# Altium schematic sheet MXM_Connector.SchDoc
size D
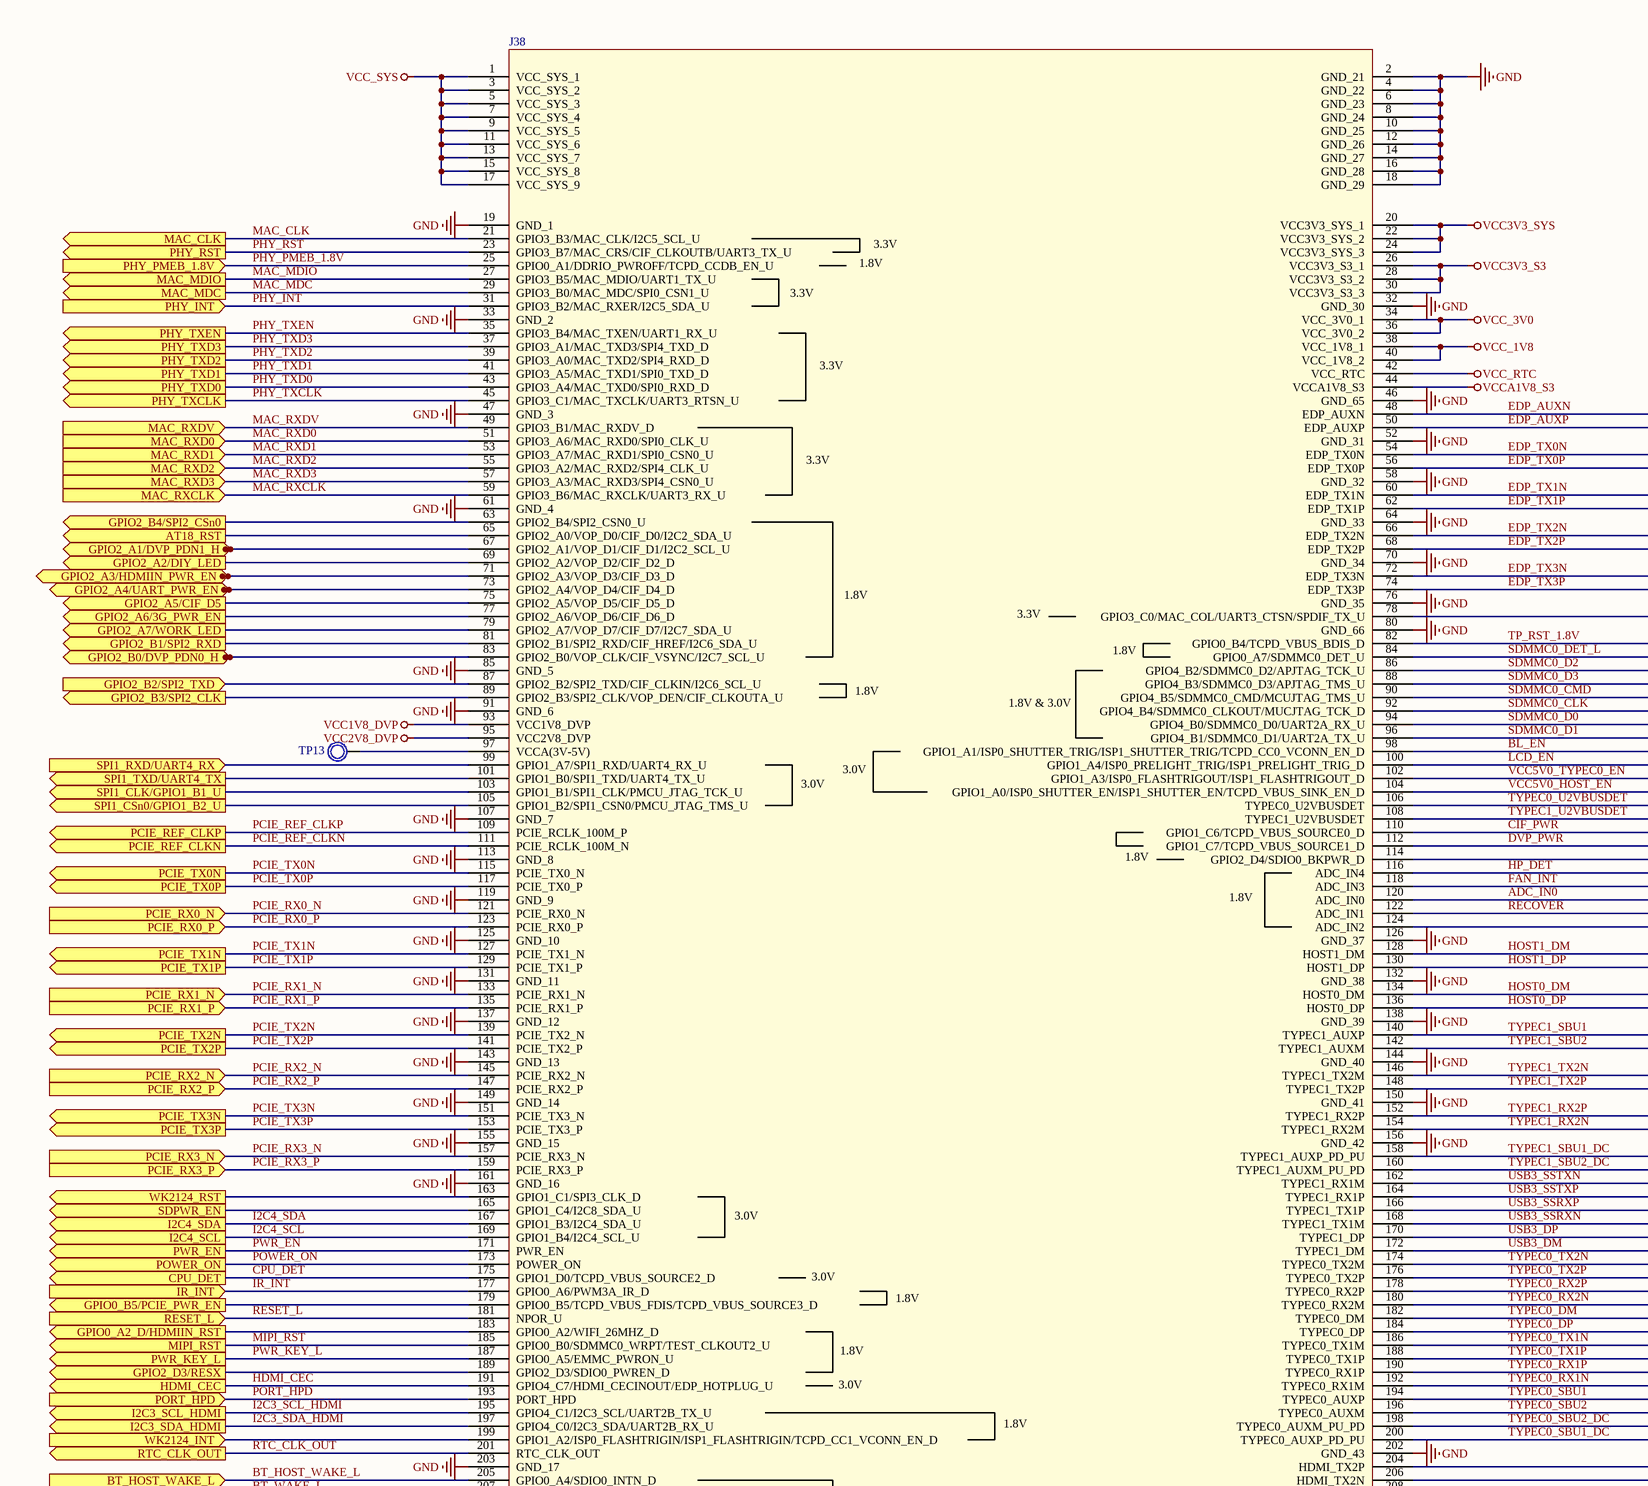
[diagram p0: MXM_Connector.SchDoc, top left]
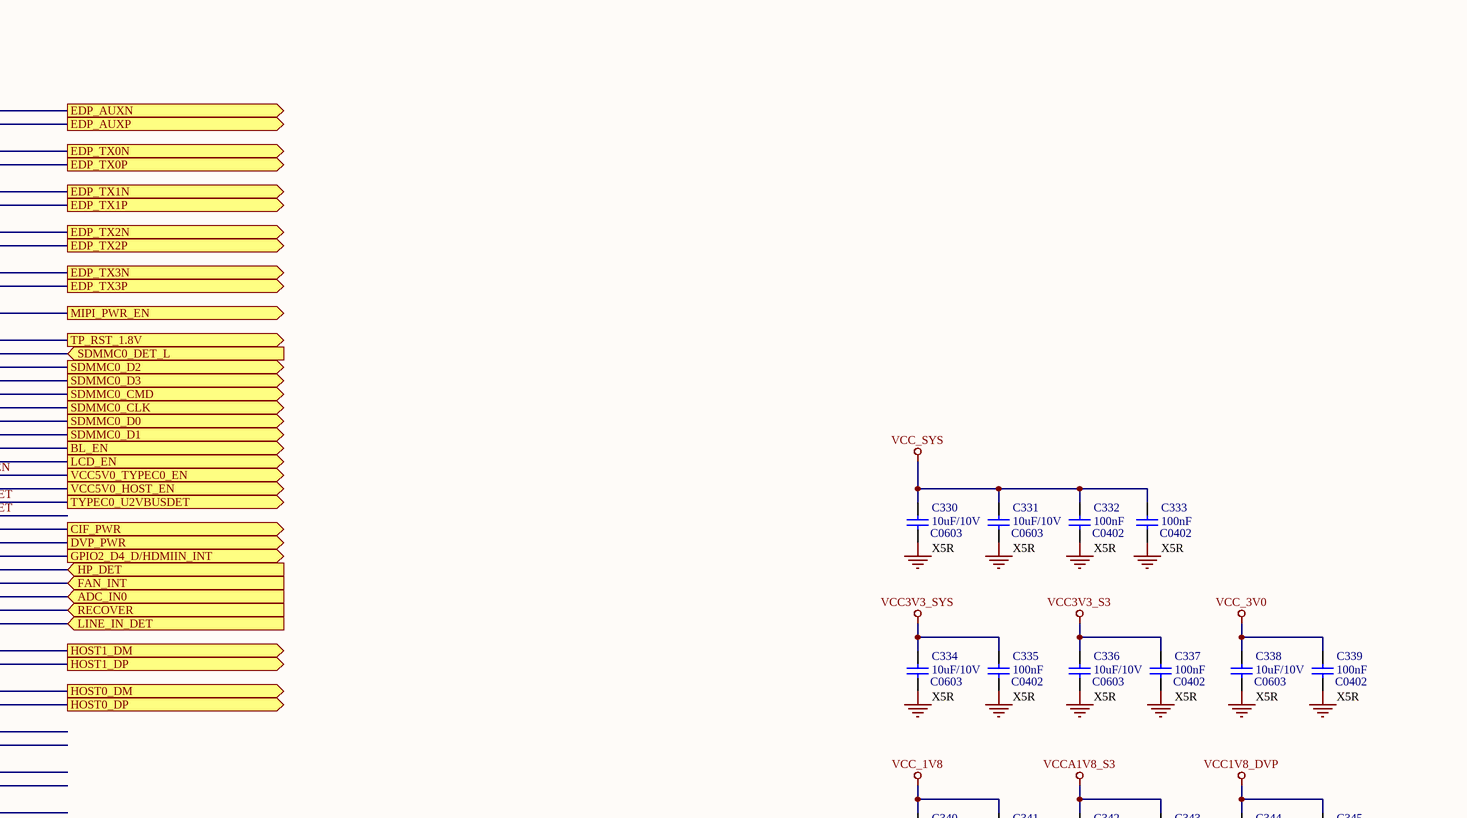
[diagram p1: MXM_Connector.SchDoc, top right]
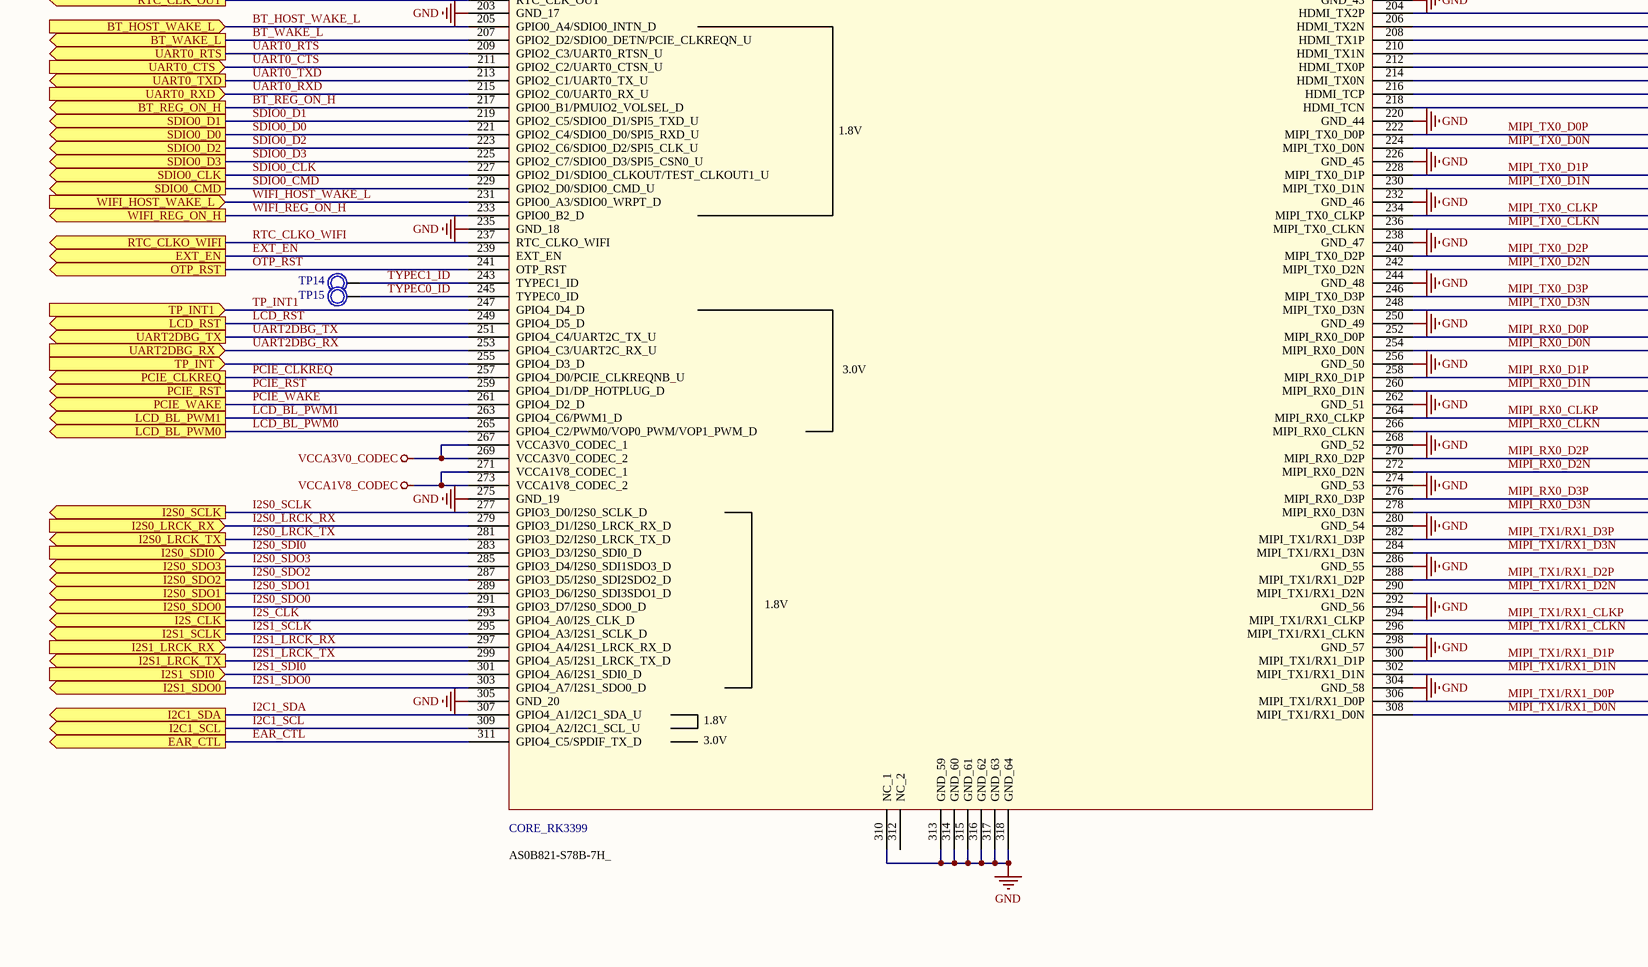
[diagram p2: MXM_Connector.SchDoc, bottom left]
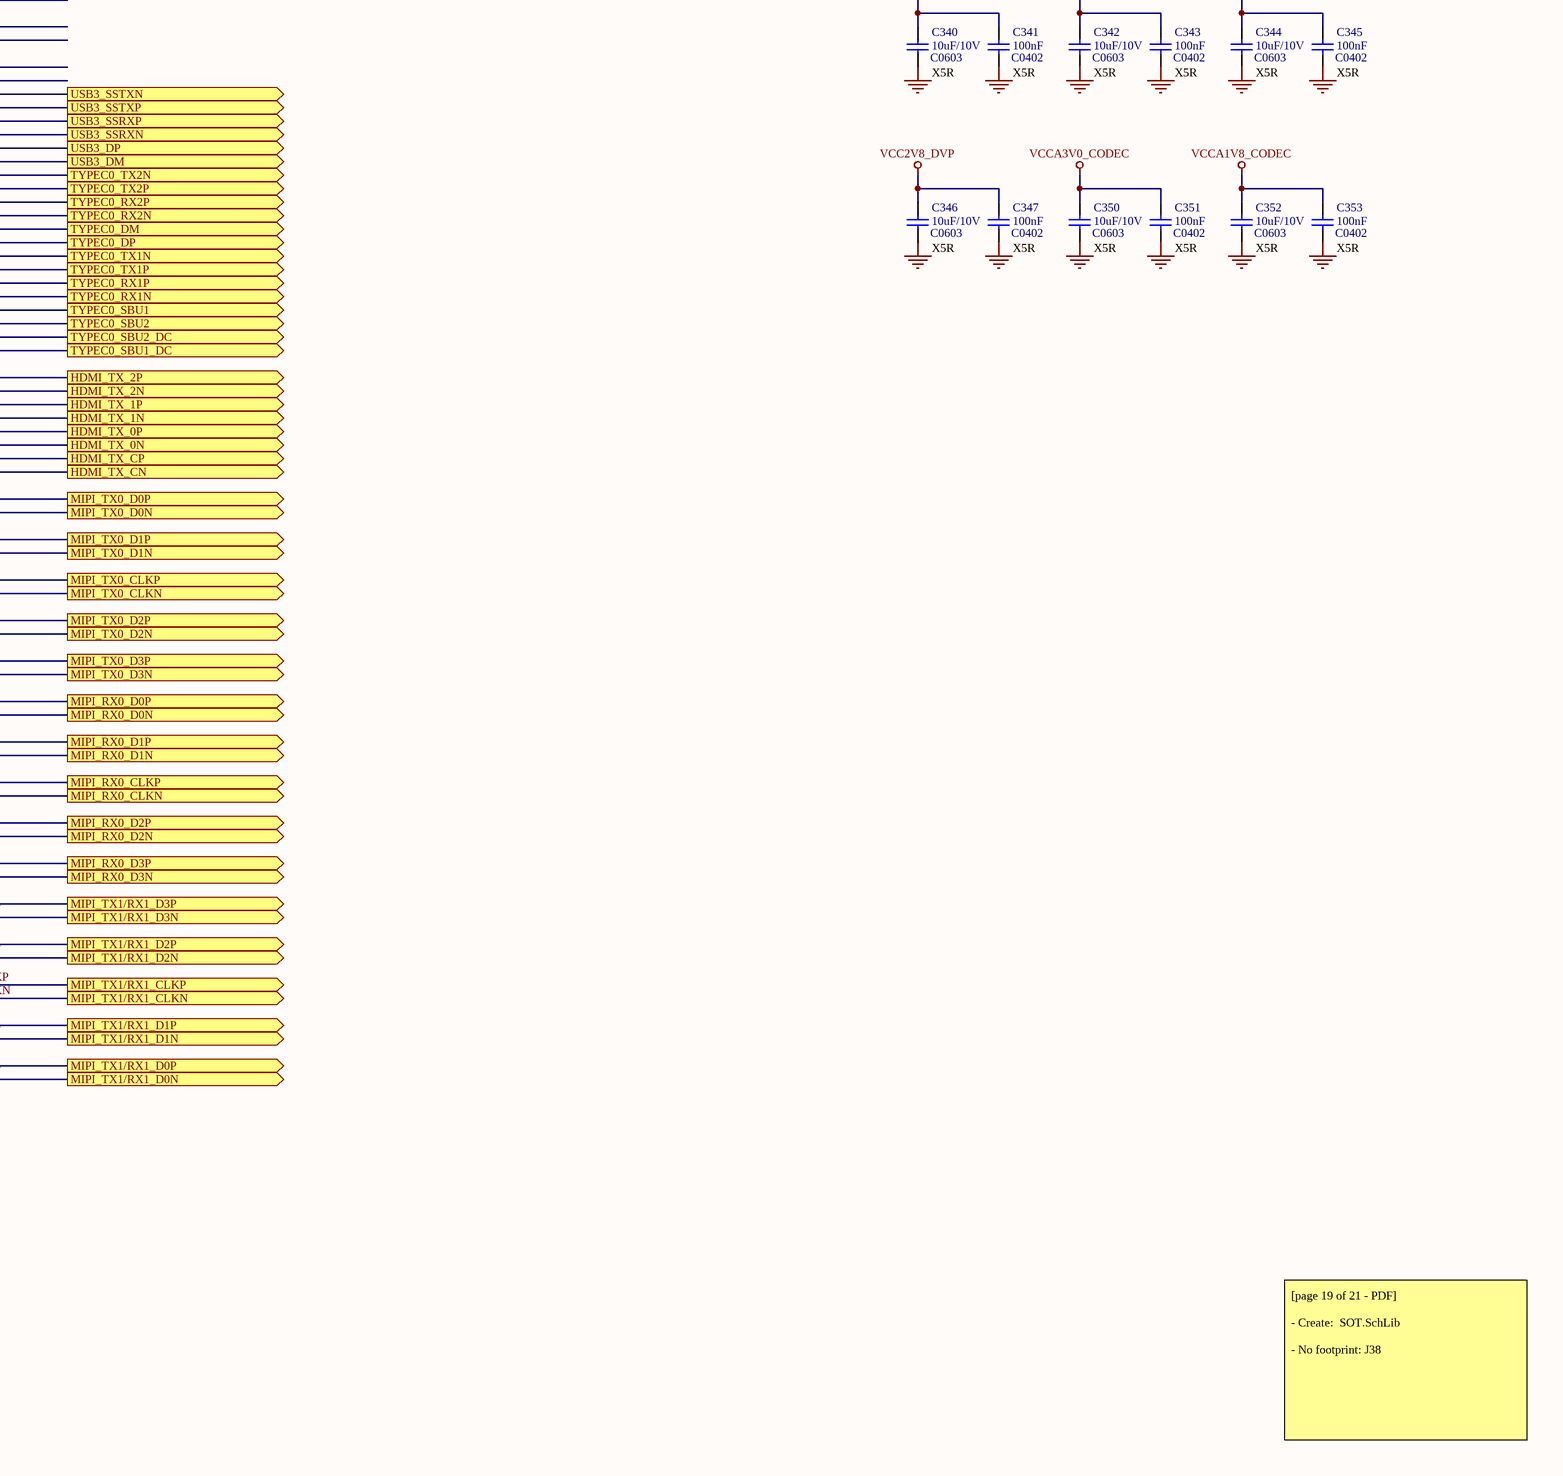
[diagram p3: MXM_Connector.SchDoc, bottom right]

## Parts
C330  C0603  value 10uF/10V  [C 0603]
C331  C0603  value 10uF/10V  [C 0603]
C332  C0402  value 100nF  [C 0402]
C333  C0402  value 100nF  [C 0402]
C334  C0603  value 10uF/10V  [C 0603]
C335  C0402  value 100nF  [C 0402]
C336  C0603  value 10uF/10V  [C 0603]
C337  C0402  value 100nF  [C 0402]
C338  C0603  value 10uF/10V  [C 0603]
C339  C0402  value 100nF  [C 0402]
C340  C0603  value 10uF/10V  [C 0603]
C341  C0402  value 100nF  [C 0402]
C342  C0603  value 10uF/10V  [C 0603]
C343  C0402  value 100nF  [C 0402]
C344  C0603  value 10uF/10V  [C 0603]
C345  C0402  value 100nF  [C 0402]
C346  C0603  value 10uF/10V  [C 0603]
C347  C0402  value 100nF  [C 0402]
C350  C0603  value 10uF/10V  [C 0603]
C351  C0402  value 100nF  [C 0402]
C352  C0603  value 10uF/10V  [C 0603]
C353  C0402  value 100nF  [C 0402]
J38  CORE_RK3399  Package: AS0B821-S78B-7H_  [*FOX_AS0B821-S78B-7H_AS0B821-S78B-7H(Primary)]
TP13  TP  [TP1]  (value not drawn)
TP14  TP  [TP1]  (value not drawn)
TP15  TP  [TP1]  (value not drawn)

## Ports
ADC_IN0 (in), AT18_RST (out), BL_EN (out), BT_HOST_WAKE_L (in), BT_REG_ON_H (out), BT_WAKE_L (out), CIF_PWR (out), CPU_DET (out), DVP_PWR (out), EAR_CTL (out), EDP_AUXN (out), EDP_AUXP (out), EDP_TX0N (out), EDP_TX0P (out), EDP_TX1N (out), EDP_TX1P (out), EDP_TX2N (out), EDP_TX2P (out), EDP_TX3N (out), EDP_TX3P (out), EXT_EN (out), FAN_INT (in), GPIO0_A2_D/HDMIIN_RST (out), GPIO0_B5/PCIE_PWR_EN (out), GPIO2_A1/DVP_PDN1_H (out), GPIO2_A2/DIY_LED (out), GPIO2_A3/HDMIIN_PWR_EN (out), GPIO2_A4/UART_PWR_EN (out), GPIO2_A5/CIF_D5 (out), GPIO2_A6/3G_PWR_EN (out), GPIO2_A7/WORK_LED (out), GPIO2_B0/DVP_PDN0_H (out), GPIO2_B1/SPI2_RXD (out), GPIO2_B2/SPI2_TXD (in), GPIO2_B3/SPI2_CLK (out), GPIO2_B4/SPI2_CSn0 (out), GPIO2_D3/RESX (out), GPIO2_D4_D/HDMIIN_INT (out), HDMI_CEC (out), HDMI_TX_0N (out), HDMI_TX_0P (out), HDMI_TX_1N (out), HDMI_TX_1P (out), HDMI_TX_2N (out), HDMI_TX_2P (out), HDMI_TX_CN (out), HDMI_TX_CP (out), HOST0_DM (out), HOST0_DP (out), HOST1_DM (out), HOST1_DP (out), HP_DET (in), I2C1_SCL (out), I2C1_SDA (out), I2C3_SCL_HDMI (out), I2C3_SDA_HDMI (out), I2C4_SCL (out), I2C4_SDA (out), I2S0_LRCK_RX (in), I2S0_LRCK_TX (out), I2S0_SCLK (out), I2S0_SDI0 (in), I2S0_SDO0 (out), I2S0_SDO1 (out), I2S0_SDO2 (out), I2S0_SDO3 (out), I2S1_LRCK_RX (in), I2S1_LRCK_TX (out), I2S1_SCLK (out), I2S1_SDI0 (in), I2S1_SDO0 (out), I2S_CLK (out), IR_INT (in), LCD_BL_PWM0 (out), LCD_BL_PWM1 (out), LCD_EN (out), LCD_RST (out), LINE_IN_DET (in), MAC_CLK (out), MAC_MDC (out), MAC_MDIO (out), MAC_RXCLK (in), MAC_RXD0 (in), MAC_RXD1 (in), MAC_RXD2 (in), MAC_RXD3 (in), MAC_RXDV (in), MIPI_PWR_EN (out), MIPI_RST (out), MIPI_RX0_CLKN (out), MIPI_RX0_CLKP (out), MIPI_RX0_D0N (out), MIPI_RX0_D0P (out), MIPI_RX0_D1N (out), MIPI_RX0_D1P (out), MIPI_RX0_D2N (out), MIPI_RX0_D2P (out), MIPI_RX0_D3N (out), MIPI_RX0_D3P (out), MIPI_TX0_CLKN (out), MIPI_TX0_CLKP (out), MIPI_TX0_D0N (out), MIPI_TX0_D0P (out), MIPI_TX0_D1N (out), MIPI_TX0_D1P (out), MIPI_TX0_D2N (out), MIPI_TX0_D2P (out), MIPI_TX0_D3N (out), MIPI_TX0_D3P (out), MIPI_TX1/RX1_CLKN (out), MIPI_TX1/RX1_CLKP (out), MIPI_TX1/RX1_D0N (out), MIPI_TX1/RX1_D0P (out), MIPI_TX1/RX1_D1N (out), MIPI_TX1/RX1_D1P (out), MIPI_TX1/RX1_D2N (out), MIPI_TX1/RX1_D2P (out), MIPI_TX1/RX1_D3N (out), MIPI_TX1/RX1_D3P (out), OTP_RST (out), PCIE_CLKREQ (out), PCIE_REF_CLKN (out), PCIE_REF_CLKP (out), PCIE_RST (out), PCIE_RX0_N (in), PCIE_RX0_P (in), PCIE_RX1_N (in), PCIE_RX1_P (in), PCIE_RX2_N (in), PCIE_RX2_P (in), PCIE_RX3_N (in), PCIE_RX3_P (in), PCIE_TX0N (out), PCIE_TX0P (out), PCIE_TX1N (out), PCIE_TX1P (out), PCIE_TX2N (out), PCIE_TX2P (out), PCIE_TX3N (out), PCIE_TX3P (out), PCIE_WAKE (out), PHY_INT (in), PHY_PMEB_1.8V (in), PHY_RST (out), PHY_TXCLK (out), PHY_TXD0 (out), PHY_TXD1 (out), PHY_TXD2 (out), PHY_TXD3 (out), PHY_TXEN (out), PORT_HPD (in), POWER_ON (out), PWR_EN (out), PWR_KEY_L (out), RECOVER (in), RESET_L (in), RTC_CLK_OUT (out), RTC_CLKO_WIFI (out), SDIO0_CLK (out), SDIO0_CMD (out), SDIO0_D0 (out), SDIO0_D1 (out), SDIO0_D2 (out), SDIO0_D3 (out), SDMMC0_CLK (out), SDMMC0_CMD (out), SDMMC0_D0 (out), SDMMC0_D1 (out), SDMMC0_D2 (out), SDMMC0_D3 (out), SDMMC0_DET_L (in), SDPWR_EN (out), SPI1_CLK/GPIO1_B1_U (out), SPI1_CSn0/GPIO1_B2_U (out), SPI1_RXD/UART4_RX (in), SPI1_TXD/UART4_TX (out), TP_INT1 (in), TP_INT (in), TP_RST_1.8V (out), TYPEC0_DM (out), TYPEC0_DP (out), TYPEC0_RX1N (out), TYPEC0_RX1P (out), TYPEC0_RX2N (out), TYPEC0_RX2P (out), TYPEC0_SBU1 (out), TYPEC0_SBU1_DC (out), TYPEC0_SBU2 (out), TYPEC0_SBU2_DC (out), TYPEC0_TX1N (out), TYPEC0_TX1P (out), TYPEC0_TX2N (out), TYPEC0_TX2P (out), TYPEC0_U2VBUSDET (out), UART0_CTS (in), UART0_RTS (out), UART0_RXD (in), UART0_TXD (out), UART2DBG_RX (in), UART2DBG_TX (out), USB3_DM (out), USB3_DP (out), USB3_SSRXN (out), USB3_SSRXP (out), USB3_SSTXN (out), USB3_SSTXP (out), VCC5V0_HOST_EN (out), VCC5V0_TYPEC0_EN (out), WIFI_HOST_WAKE_L (in), WIFI_REG_ON_H (out), WK2124_INT (in), WK2124_RST (out)

## Nets
GND: C330.2 C331.2 C332.2 C333.2 C334.2 C335.2 C336.2 C337.2 C338.2 C339.2 C340.2 C341.2 C342.2 C343.2 C344.2 C345.2 C346.2 C347.2 C350.2 C351.2 C352.2 C353.2 J38.2(GND_21) J38.4(GND_22) J38.6(GND_23) J38.8(GND_24) J38.10(GND_25) J38.12(GND_26) J38.14(GND_27) J38.16(GND_28) J38.18(GND_29) J38.19(GND_1) J38.32(GND_30) J38.33(GND_2) J38.46(GND_65) J38.47(GND_3) J38.52(GND_31) J38.58(GND_32) J38.61(GND_4) J38.64(GND_33) J38.70(GND_34) J38.76(GND_35) J38.80(GND_66) J38.85(GND_5) J38.91(GND_6) J38.107(GND_7) J38.113(GND_8) J38.119(GND_9) J38.125(GND_10) J38.126(GND_37) J38.131(GND_11) J38.132(GND_38) J38.137(GND_12) J38.138(GND_39) J38.143(GND_13) J38.144(GND_40) J38.149(GND_14) J38.150(GND_41) J38.155(GND_15) J38.156(GND_42) J38.161(GND_16) J38.202(GND_43) J38.203(GND_17) J38.220(GND_44) J38.226(GND_45) J38.232(GND_46) J38.235(GND_18) J38.238(GND_47) J38.244(GND_48) J38.250(GND_49) J38.256(GND_50) J38.262(GND_51) J38.268(GND_52) J38.274(GND_53) J38.275(GND_19) J38.280(GND_54) J38.286(GND_55) J38.292(GND_56) J38.298(GND_57) J38.304(GND_58) J38.305(GND_20) J38.310(NC_1) J38.313(GND_59) J38.314(GND_60) J38.315(GND_61) J38.316(GND_62) J38.317(GND_63) J38.318(GND_64)
VCC1V8_DVP: C344.1 C345.1 J38.93(VCC1V8_DVP)
VCC2V8_DVP: C346.1 C347.1 J38.95(VCC2V8_DVP)
VCC3V3_S3: C336.1 C337.1 J38.26(VCC3V3_S3_1) J38.28(VCC3V3_S3_2) J38.30(VCC3V3_S3_3)
VCC3V3_SYS: C334.1 C335.1 J38.20(VCC3V3_SYS_1) J38.22(VCC3V3_SYS_2) J38.24(VCC3V3_SYS_3)
VCC_1V8: C340.1 C341.1 J38.38(VCC_1V8_1) J38.40(VCC_1V8_2)
VCC_3V0: C338.1 C339.1 J38.34(VCC_3V0_1) J38.36(VCC_3V0_2)
VCC_RTC: J38.42(VCC_RTC)
VCC_SYS: C330.1 C331.1 C332.1 C333.1 J38.1(VCC_SYS_1) J38.3(VCC_SYS_2) J38.5(VCC_SYS_3) J38.7(VCC_SYS_4) J38.9(VCC_SYS_5) J38.11(VCC_SYS_6) J38.13(VCC_SYS_7) J38.15(VCC_SYS_8) J38.17(VCC_SYS_9)
VCCA1V8_CODEC: C352.1 C353.1 J38.271(VCCA1V8_CODEC_1) J38.273(VCCA1V8_CODEC_2)
VCCA1V8_S3: C342.1 C343.1 J38.44(VCCA1V8_S3)
VCCA3V0_CODEC: C350.1 C351.1 J38.267(VCCA3V0_CODEC_1) J38.269(VCCA3V0_CODEC_2)
ADC_IN0: J38.120(ADC_IN0) ; port ADC_IN0
AT18_RST: J38.65(GPIO2_A0/VOP_D0/CIF_D0/I2C2_SDA_U) ; port AT18_RST
BL_EN: J38.98(GPIO1_A1/ISP0_SHUTTER_TRIG/ISP1_SHUTTER_TRIG/TCPD_CC0_VCONN_EN_D) ; port BL_EN
BT_HOST_WAKE_L: J38.205(GPIO0_A4/SDIO0_INTN_D) ; port BT_HOST_WAKE_L
BT_REG_ON_H: J38.217(GPIO0_B1/PMUIO2_VOLSEL_D) ; port BT_REG_ON_H
BT_WAKE_L: J38.207(GPIO2_D2/SDIO0_DETN/PCIE_CLKREQN_U) ; port BT_WAKE_L
CIF_PWR: J38.110(GPIO1_C6/TCPD_VBUS_SOURCE0_D) ; port CIF_PWR
CPU_DET: J38.175(GPIO1_D0/TCPD_VBUS_SOURCE2_D) ; port CPU_DET
DVP_PWR: J38.112(GPIO1_C7/TCPD_VBUS_SOURCE1_D) ; port DVP_PWR
EAR_CTL: J38.311(GPIO4_C5/SPDIF_TX_D) ; port EAR_CTL
EDP_AUXN: J38.48(EDP_AUXN) ; port EDP_AUXN
EDP_AUXP: J38.50(EDP_AUXP) ; port EDP_AUXP
EDP_TX0N: J38.54(EDP_TX0N) ; port EDP_TX0N
EDP_TX0P: J38.56(EDP_TX0P) ; port EDP_TX0P
EDP_TX1N: J38.60(EDP_TX1N) ; port EDP_TX1N
EDP_TX1P: J38.62(EDP_TX1P) ; port EDP_TX1P
EDP_TX2N: J38.66(EDP_TX2N) ; port EDP_TX2N
EDP_TX2P: J38.68(EDP_TX2P) ; port EDP_TX2P
EDP_TX3N: J38.72(EDP_TX3N) ; port EDP_TX3N
EDP_TX3P: J38.74(EDP_TX3P) ; port EDP_TX3P
EXT_EN: J38.239(EXT_EN) ; port EXT_EN
FAN_INT: J38.118(ADC_IN3) ; port FAN_INT
GPIO0_A2_D/HDMIIN_RST: J38.183(GPIO0_A2/WIFI_26MHZ_D) ; port GPIO0_A2_D/HDMIIN_RST
GPIO0_B5/PCIE_PWR_EN: J38.179(GPIO0_B5/TCPD_VBUS_FDIS/TCPD_VBUS_SOURCE3_D) ; port GPIO0_B5/PCIE_PWR_EN
GPIO2_A1/DVP_PDN1_H: J38.67(GPIO2_A1/VOP_D1/CIF_D1/I2C2_SCL_U) ; port GPIO2_A1/DVP_PDN1_H
GPIO2_A2/DIY_LED: J38.69(GPIO2_A2/VOP_D2/CIF_D2_D) ; port GPIO2_A2/DIY_LED
GPIO2_A3/HDMIIN_PWR_EN: J38.71(GPIO2_A3/VOP_D3/CIF_D3_D) ; port GPIO2_A3/HDMIIN_PWR_EN
GPIO2_A4/UART_PWR_EN: J38.73(GPIO2_A4/VOP_D4/CIF_D4_D) ; port GPIO2_A4/UART_PWR_EN
GPIO2_A5/CIF_D5: J38.75(GPIO2_A5/VOP_D5/CIF_D5_D) ; port GPIO2_A5/CIF_D5
GPIO2_A6/3G_PWR_EN: J38.77(GPIO2_A6/VOP_D6/CIF_D6_D) ; port GPIO2_A6/3G_PWR_EN
GPIO2_A7/WORK_LED: J38.79(GPIO2_A7/VOP_D7/CIF_D7/I2C7_SDA_U) ; port GPIO2_A7/WORK_LED
GPIO2_B0/DVP_PDN0_H: J38.83(GPIO2_B0/VOP_CLK/CIF_VSYNC/I2C7_SCL_U) ; port GPIO2_B0/DVP_PDN0_H
GPIO2_B1/SPI2_RXD: J38.81(GPIO2_B1/SPI2_RXD/CIF_HREF/I2C6_SDA_U) ; port GPIO2_B1/SPI2_RXD
GPIO2_B2/SPI2_TXD: J38.87(GPIO2_B2/SPI2_TXD/CIF_CLKIN/I2C6_SCL_U) ; port GPIO2_B2/SPI2_TXD
GPIO2_B3/SPI2_CLK: J38.89(GPIO2_B3/SPI2_CLK/VOP_DEN/CIF_CLKOUTA_U) ; port GPIO2_B3/SPI2_CLK
GPIO2_B4/SPI2_CSn0: J38.63(GPIO2_B4/SPI2_CSN0_U) ; port GPIO2_B4/SPI2_CSn0
GPIO2_D3/RESX: J38.189(GPIO2_D3/SDIO0_PWREN_D) ; port GPIO2_D3/RESX
GPIO2_D4_D/HDMIIN_INT: J38.114(GPIO2_D4/SDIO0_BKPWR_D) ; port GPIO2_D4_D/HDMIIN_INT
HDMI_CEC: J38.191(GPIO4_C7/HDMI_CECINOUT/EDP_HOTPLUG_U) ; port HDMI_CEC
HDMI_TX_0N: J38.214(HDMI_TX0N) ; port HDMI_TX_0N
HDMI_TX_0P: J38.212(HDMI_TX0P) ; port HDMI_TX_0P
HDMI_TX_1N: J38.210(HDMI_TX1N) ; port HDMI_TX_1N
HDMI_TX_1P: J38.208(HDMI_TX1P) ; port HDMI_TX_1P
HDMI_TX_2N: J38.206(HDMI_TX2N) ; port HDMI_TX_2N
HDMI_TX_2P: J38.204(HDMI_TX2P) ; port HDMI_TX_2P
HDMI_TX_CN: J38.218(HDMI_TCN) ; port HDMI_TX_CN
HDMI_TX_CP: J38.216(HDMI_TCP) ; port HDMI_TX_CP
HOST0_DM: J38.134(HOST0_DM) ; port HOST0_DM
HOST0_DP: J38.136(HOST0_DP) ; port HOST0_DP
HOST1_DM: J38.128(HOST1_DM) ; port HOST1_DM
HOST1_DP: J38.130(HOST1_DP) ; port HOST1_DP
HP_DET: J38.116(ADC_IN4) ; port HP_DET
I2C1_SCL: J38.309(GPIO4_A2/I2C1_SCL_U) ; port I2C1_SCL
I2C1_SDA: J38.307(GPIO4_A1/I2C1_SDA_U) ; port I2C1_SDA
I2C3_SCL_HDMI: J38.195(GPIO4_C1/I2C3_SCL/UART2B_TX_U) ; port I2C3_SCL_HDMI
I2C3_SDA_HDMI: J38.197(GPIO4_C0/I2C3_SDA/UART2B_RX_U) ; port I2C3_SDA_HDMI
I2C4_SCL: J38.169(GPIO1_B4/I2C4_SCL_U) ; port I2C4_SCL
I2C4_SDA: J38.167(GPIO1_B3/I2C4_SDA_U) ; port I2C4_SDA
I2S0_LRCK_RX: J38.279(GPIO3_D1/I2S0_LRCK_RX_D) ; port I2S0_LRCK_RX
I2S0_LRCK_TX: J38.281(GPIO3_D2/I2S0_LRCK_TX_D) ; port I2S0_LRCK_TX
I2S0_SCLK: J38.277(GPIO3_D0/I2S0_SCLK_D) ; port I2S0_SCLK
I2S0_SDI0: J38.283(GPIO3_D3/I2S0_SDI0_D) ; port I2S0_SDI0
I2S0_SDO0: J38.291(GPIO3_D7/I2S0_SDO0_D) ; port I2S0_SDO0
I2S0_SDO1: J38.289(GPIO3_D6/I2S0_SDI3SDO1_D) ; port I2S0_SDO1
I2S0_SDO2: J38.287(GPIO3_D5/I2S0_SDI2SDO2_D) ; port I2S0_SDO2
I2S0_SDO3: J38.285(GPIO3_D4/I2S0_SDI1SDO3_D) ; port I2S0_SDO3
I2S1_LRCK_RX: J38.297(GPIO4_A4/I2S1_LRCK_RX_D) ; port I2S1_LRCK_RX
I2S1_LRCK_TX: J38.299(GPIO4_A5/I2S1_LRCK_TX_D) ; port I2S1_LRCK_TX
I2S1_SCLK: J38.295(GPIO4_A3/I2S1_SCLK_D) ; port I2S1_SCLK
I2S1_SDI0: J38.301(GPIO4_A6/I2S1_SDI0_D) ; port I2S1_SDI0
I2S1_SDO0: J38.303(GPIO4_A7/I2S1_SDO0_D) ; port I2S1_SDO0
I2S_CLK: J38.293(GPIO4_A0/I2S_CLK_D) ; port I2S_CLK
IR_INT: J38.177(GPIO0_A6/PWM3A_IR_D) ; port IR_INT
LCD_BL_PWM0: J38.265(GPIO4_C2/PWM0/VOP0_PWM/VOP1_PWM_D) ; port LCD_BL_PWM0
LCD_BL_PWM1: J38.263(GPIO4_C6/PWM1_D) ; port LCD_BL_PWM1
LCD_EN: J38.100(GPIO1_A4/ISP0_PRELIGHT_TRIG/ISP1_PRELIGHT_TRIG_D) ; port LCD_EN
LCD_RST: J38.249(GPIO4_D5_D) ; port LCD_RST
LINE_IN_DET: J38.124(ADC_IN2) ; port LINE_IN_DET
MAC_CLK: J38.21(GPIO3_B3/MAC_CLK/I2C5_SCL_U) ; port MAC_CLK
MAC_MDC: J38.29(GPIO3_B0/MAC_MDC/SPI0_CSN1_U) ; port MAC_MDC
MAC_MDIO: J38.27(GPIO3_B5/MAC_MDIO/UART1_TX_U) ; port MAC_MDIO
MAC_RXCLK: J38.59(GPIO3_B6/MAC_RXCLK/UART3_RX_U) ; port MAC_RXCLK
MAC_RXD0: J38.51(GPIO3_A6/MAC_RXD0/SPI0_CLK_U) ; port MAC_RXD0
MAC_RXD1: J38.53(GPIO3_A7/MAC_RXD1/SPI0_CSN0_U) ; port MAC_RXD1
MAC_RXD2: J38.55(GPIO3_A2/MAC_RXD2/SPI4_CLK_U) ; port MAC_RXD2
MAC_RXD3: J38.57(GPIO3_A3/MAC_RXD3/SPI4_CSN0_U) ; port MAC_RXD3
MAC_RXDV: J38.49(GPIO3_B1/MAC_RXDV_D) ; port MAC_RXDV
MIPI_PWR_EN: J38.78(GPIO3_C0/MAC_COL/UART3_CTSN/SPDIF_TX_U) ; port MIPI_PWR_EN
MIPI_RST: J38.185(GPIO0_B0/SDMMC0_WRPT/TEST_CLKOUT2_U) ; port MIPI_RST
MIPI_RX0_CLKN: J38.266(MIPI_RX0_CLKN) ; port MIPI_RX0_CLKN
MIPI_RX0_CLKP: J38.264(MIPI_RX0_CLKP) ; port MIPI_RX0_CLKP
MIPI_RX0_D0N: J38.254(MIPI_RX0_D0N) ; port MIPI_RX0_D0N
MIPI_RX0_D0P: J38.252(MIPI_RX0_D0P) ; port MIPI_RX0_D0P
MIPI_RX0_D1N: J38.260(MIPI_RX0_D1N) ; port MIPI_RX0_D1N
MIPI_RX0_D1P: J38.258(MIPI_RX0_D1P) ; port MIPI_RX0_D1P
MIPI_RX0_D2N: J38.272(MIPI_RX0_D2N) ; port MIPI_RX0_D2N
MIPI_RX0_D2P: J38.270(MIPI_RX0_D2P) ; port MIPI_RX0_D2P
MIPI_RX0_D3N: J38.278(MIPI_RX0_D3N) ; port MIPI_RX0_D3N
MIPI_RX0_D3P: J38.276(MIPI_RX0_D3P) ; port MIPI_RX0_D3P
MIPI_TX0_CLKN: J38.236(MIPI_TX0_CLKN) ; port MIPI_TX0_CLKN
MIPI_TX0_CLKP: J38.234(MIPI_TX0_CLKP) ; port MIPI_TX0_CLKP
MIPI_TX0_D0N: J38.224(MIPI_TX0_D0N) ; port MIPI_TX0_D0N
MIPI_TX0_D0P: J38.222(MIPI_TX0_D0P) ; port MIPI_TX0_D0P
MIPI_TX0_D1N: J38.230(MIPI_TX0_D1N) ; port MIPI_TX0_D1N
MIPI_TX0_D1P: J38.228(MIPI_TX0_D1P) ; port MIPI_TX0_D1P
MIPI_TX0_D2N: J38.242(MIPI_TX0_D2N) ; port MIPI_TX0_D2N
MIPI_TX0_D2P: J38.240(MIPI_TX0_D2P) ; port MIPI_TX0_D2P
MIPI_TX0_D3N: J38.248(MIPI_TX0_D3N) ; port MIPI_TX0_D3N
MIPI_TX0_D3P: J38.246(MIPI_TX0_D3P) ; port MIPI_TX0_D3P
MIPI_TX1/RX1_CLKN: J38.296(MIPI_TX1/RX1_CLKN) ; port MIPI_TX1/RX1_CLKN
MIPI_TX1/RX1_CLKP: J38.294(MIPI_TX1/RX1_CLKP) ; port MIPI_TX1/RX1_CLKP
MIPI_TX1/RX1_D0N: J38.308(MIPI_TX1/RX1_D0N) ; port MIPI_TX1/RX1_D0N
MIPI_TX1/RX1_D0P: J38.306(MIPI_TX1/RX1_D0P) ; port MIPI_TX1/RX1_D0P
MIPI_TX1/RX1_D1N: J38.302(MIPI_TX1/RX1_D1N) ; port MIPI_TX1/RX1_D1N
MIPI_TX1/RX1_D1P: J38.300(MIPI_TX1/RX1_D1P) ; port MIPI_TX1/RX1_D1P
MIPI_TX1/RX1_D2N: J38.290(MIPI_TX1/RX1_D2N) ; port MIPI_TX1/RX1_D2N
MIPI_TX1/RX1_D2P: J38.288(MIPI_TX1/RX1_D2P) ; port MIPI_TX1/RX1_D2P
MIPI_TX1/RX1_D3N: J38.284(MIPI_TX1/RX1_D3N) ; port MIPI_TX1/RX1_D3N
MIPI_TX1/RX1_D3P: J38.282(MIPI_TX1/RX1_D3P) ; port MIPI_TX1/RX1_D3P
OTP_RST: J38.241(OTP_RST) ; port OTP_RST
PCIE_CLKREQ: J38.257(GPIO4_D0/PCIE_CLKREQNB_U) ; port PCIE_CLKREQ
PCIE_REF_CLKN: J38.111(PCIE_RCLK_100M_N) ; port PCIE_REF_CLKN
PCIE_REF_CLKP: J38.109(PCIE_RCLK_100M_P) ; port PCIE_REF_CLKP
PCIE_RST: J38.259(GPIO4_D1/DP_HOTPLUG_D) ; port PCIE_RST
PCIE_RX0_N: J38.121(PCIE_RX0_N) ; port PCIE_RX0_N
PCIE_RX0_P: J38.123(PCIE_RX0_P) ; port PCIE_RX0_P
PCIE_RX1_N: J38.133(PCIE_RX1_N) ; port PCIE_RX1_N
PCIE_RX1_P: J38.135(PCIE_RX1_P) ; port PCIE_RX1_P
PCIE_RX2_N: J38.145(PCIE_RX2_N) ; port PCIE_RX2_N
PCIE_RX2_P: J38.147(PCIE_RX2_P) ; port PCIE_RX2_P
PCIE_RX3_N: J38.157(PCIE_RX3_N) ; port PCIE_RX3_N
PCIE_RX3_P: J38.159(PCIE_RX3_P) ; port PCIE_RX3_P
PCIE_TX0N: J38.115(PCIE_TX0_N) ; port PCIE_TX0N
PCIE_TX0P: J38.117(PCIE_TX0_P) ; port PCIE_TX0P
PCIE_TX1N: J38.127(PCIE_TX1_N) ; port PCIE_TX1N
PCIE_TX1P: J38.129(PCIE_TX1_P) ; port PCIE_TX1P
PCIE_TX2N: J38.139(PCIE_TX2_N) ; port PCIE_TX2N
PCIE_TX2P: J38.141(PCIE_TX2_P) ; port PCIE_TX2P
PCIE_TX3N: J38.151(PCIE_TX3_N) ; port PCIE_TX3N
PCIE_TX3P: J38.153(PCIE_TX3_P) ; port PCIE_TX3P
PCIE_WAKE: J38.261(GPIO4_D2_D) ; port PCIE_WAKE
PHY_INT: J38.31(GPIO3_B2/MAC_RXER/I2C5_SDA_U) ; port PHY_INT
PHY_PMEB_1.8V: J38.25(GPIO0_A1/DDRIO_PWROFF/TCPD_CCDB_EN_U) ; port PHY_PMEB_1.8V
PHY_RST: J38.23(GPIO3_B7/MAC_CRS/CIF_CLKOUTB/UART3_TX_U) ; port PHY_RST
PHY_TXCLK: J38.45(GPIO3_C1/MAC_TXCLK/UART3_RTSN_U) ; port PHY_TXCLK
PHY_TXD0: J38.43(GPIO3_A4/MAC_TXD0/SPI0_RXD_D) ; port PHY_TXD0
PHY_TXD1: J38.41(GPIO3_A5/MAC_TXD1/SPI0_TXD_D) ; port PHY_TXD1
PHY_TXD2: J38.39(GPIO3_A0/MAC_TXD2/SPI4_RXD_D) ; port PHY_TXD2
PHY_TXD3: J38.37(GPIO3_A1/MAC_TXD3/SPI4_TXD_D) ; port PHY_TXD3
PHY_TXEN: J38.35(GPIO3_B4/MAC_TXEN/UART1_RX_U) ; port PHY_TXEN
PORT_HPD: J38.193(PORT_HPD) ; port PORT_HPD
POWER_ON: J38.173(POWER_ON) ; port POWER_ON
PWR_EN: J38.171(PWR_EN) ; port PWR_EN
PWR_KEY_L: J38.187(GPIO0_A5/EMMC_PWRON_U) ; port PWR_KEY_L
RECOVER: J38.122(ADC_IN1) ; port RECOVER
RESET_L: J38.181(NPOR_U) ; port RESET_L
RTC_CLK_OUT: J38.201(RTC_CLK_OUT) ; port RTC_CLK_OUT
RTC_CLKO_WIFI: J38.237(RTC_CLKO_WIFI) ; port RTC_CLKO_WIFI
SDIO0_CLK: J38.227(GPIO2_D1/SDIO0_CLKOUT/TEST_CLKOUT1_U) ; port SDIO0_CLK
SDIO0_CMD: J38.229(GPIO2_D0/SDIO0_CMD_U) ; port SDIO0_CMD
SDIO0_D0: J38.221(GPIO2_C4/SDIO0_D0/SPI5_RXD_U) ; port SDIO0_D0
SDIO0_D1: J38.219(GPIO2_C5/SDIO0_D1/SPI5_TXD_U) ; port SDIO0_D1
SDIO0_D2: J38.223(GPIO2_C6/SDIO0_D2/SPI5_CLK_U) ; port SDIO0_D2
SDIO0_D3: J38.225(GPIO2_C7/SDIO0_D3/SPI5_CSN0_U) ; port SDIO0_D3
SDMMC0_CLK: J38.92(GPIO4_B4/SDMMC0_CLKOUT/MUCJTAG_TCK_D) ; port SDMMC0_CLK
SDMMC0_CMD: J38.90(GPIO4_B5/SDMMC0_CMD/MCUJTAG_TMS_U) ; port SDMMC0_CMD
SDMMC0_D0: J38.94(GPIO4_B0/SDMMC0_D0/UART2A_RX_U) ; port SDMMC0_D0
SDMMC0_D1: J38.96(GPIO4_B1/SDMMC0_D1/UART2A_TX_U) ; port SDMMC0_D1
SDMMC0_D2: J38.86(GPIO4_B2/SDMMC0_D2/APJTAG_TCK_U) ; port SDMMC0_D2
SDMMC0_D3: J38.88(GPIO4_B3/SDMMC0_D3/APJTAG_TMS_U) ; port SDMMC0_D3
SDMMC0_DET_L: J38.84(GPIO0_A7/SDMMC0_DET_U) ; port SDMMC0_DET_L
SDPWR_EN: J38.165(GPIO1_C4/I2C8_SDA_U) ; port SDPWR_EN
SPI1_CLK/GPIO1_B1_U: J38.103(GPIO1_B1/SPI1_CLK/PMCU_JTAG_TCK_U) ; port SPI1_CLK/GPIO1_B1_U
SPI1_CSn0/GPIO1_B2_U: J38.105(GPIO1_B2/SPI1_CSN0/PMCU_JTAG_TMS_U) ; port SPI1_CSn0/GPIO1_B2_U
SPI1_RXD/UART4_RX: J38.99(GPIO1_A7/SPI1_RXD/UART4_RX_U) ; port SPI1_RXD/UART4_RX
SPI1_TXD/UART4_TX: J38.101(GPIO1_B0/SPI1_TXD/UART4_TX_U) ; port SPI1_TXD/UART4_TX
TP_INT: J38.255(GPIO4_D3_D) ; port TP_INT
TP_INT1: J38.247(GPIO4_D4_D) ; port TP_INT1
TP_RST_1.8V: J38.82(GPIO0_B4/TCPD_VBUS_BDIS_D) ; port TP_RST_1.8V
TYPEC0_DM: J38.182(TYPEC0_DM) ; port TYPEC0_DM
TYPEC0_DP: J38.184(TYPEC0_DP) ; port TYPEC0_DP
TYPEC0_ID: J38.245(TYPEC0_ID) TP15.1
TYPEC0_RX1N: J38.192(TYPEC0_RX1M) ; port TYPEC0_RX1N
TYPEC0_RX1P: J38.190(TYPEC0_RX1P) ; port TYPEC0_RX1P
TYPEC0_RX2N: J38.180(TYPEC0_RX2M) ; port TYPEC0_RX2N
TYPEC0_RX2P: J38.178(TYPEC0_RX2P) ; port TYPEC0_RX2P
TYPEC0_SBU1: J38.194(TYPEC0_AUXP) ; port TYPEC0_SBU1
TYPEC0_SBU1_DC: J38.200(TYPEC0_AUXP_PD_PU) ; port TYPEC0_SBU1_DC
TYPEC0_SBU2: J38.196(TYPEC0_AUXM) ; port TYPEC0_SBU2
TYPEC0_SBU2_DC: J38.198(TYPEC0_AUXM_PU_PD) ; port TYPEC0_SBU2_DC
TYPEC0_TX1N: J38.186(TYPEC0_TX1M) ; port TYPEC0_TX1N
TYPEC0_TX1P: J38.188(TYPEC0_TX1P) ; port TYPEC0_TX1P
TYPEC0_TX2N: J38.174(TYPEC0_TX2M) ; port TYPEC0_TX2N
TYPEC0_TX2P: J38.176(TYPEC0_TX2P) ; port TYPEC0_TX2P
TYPEC0_U2VBUSDET: J38.106(TYPEC0_U2VBUSDET) ; port TYPEC0_U2VBUSDET
TYPEC1_ID: J38.243(TYPEC1_ID) TP14.1
TYPEC1_RX2N: J38.154(TYPEC1_RX2M)
TYPEC1_RX2P: J38.152(TYPEC1_RX2P)
TYPEC1_SBU1: J38.140(TYPEC1_AUXP)
TYPEC1_SBU1_DC: J38.158(TYPEC1_AUXP_PD_PU)
TYPEC1_SBU2: J38.142(TYPEC1_AUXM)
TYPEC1_SBU2_DC: J38.160(TYPEC1_AUXM_PU_PD)
TYPEC1_TX2N: J38.146(TYPEC1_TX2M)
TYPEC1_TX2P: J38.148(TYPEC1_TX2P)
TYPEC1_U2VBUSDET: J38.108(TYPEC1_U2VBUSDET)
UART0_CTS: J38.211(GPIO2_C2/UART0_CTSN_U) ; port UART0_CTS
UART0_RTS: J38.209(GPIO2_C3/UART0_RTSN_U) ; port UART0_RTS
UART0_RXD: J38.215(GPIO2_C0/UART0_RX_U) ; port UART0_RXD
UART0_TXD: J38.213(GPIO2_C1/UART0_TX_U) ; port UART0_TXD
UART2DBG_RX: J38.253(GPIO4_C3/UART2C_RX_U) ; port UART2DBG_RX
UART2DBG_TX: J38.251(GPIO4_C4/UART2C_TX_U) ; port UART2DBG_TX
USB3_DM: J38.172(TYPEC1_DM) ; port USB3_DM
USB3_DP: J38.170(TYPEC1_DP) ; port USB3_DP
USB3_SSRXN: J38.168(TYPEC1_TX1M) ; port USB3_SSRXN
USB3_SSRXP: J38.166(TYPEC1_TX1P) ; port USB3_SSRXP
USB3_SSTXN: J38.162(TYPEC1_RX1M) ; port USB3_SSTXN
USB3_SSTXP: J38.164(TYPEC1_RX1P) ; port USB3_SSTXP
VCC5V0_HOST_EN: J38.104(GPIO1_A0/ISP0_SHUTTER_EN/ISP1_SHUTTER_EN/TCPD_VBUS_SINK_EN_D) ; port VCC5V0_HOST_EN
VCC5V0_TYPEC0_EN: J38.102(GPIO1_A3/ISP0_FLASHTRIGOUT/ISP1_FLASHTRIGOUT_D) ; port VCC5V0_TYPEC0_EN
WIFI_HOST_WAKE_L: J38.231(GPIO0_A3/SDIO0_WRPT_D) ; port WIFI_HOST_WAKE_L
WIFI_REG_ON_H: J38.233(GPIO0_B2_D) ; port WIFI_REG_ON_H
WK2124_INT: J38.199(GPIO1_A2/ISP0_FLASHTRIGIN/ISP1_FLASHTRIGIN/TCPD_CC1_VCONN_EN_D) ; port WK2124_INT
WK2124_RST: J38.163(GPIO1_C1/SPI3_CLK_D) ; port WK2124_RST
NetJ38_97: J38.97(VCCA(3V-5V)) TP13.1

Not connected (* = marked no-connect by the designer): J38 312(NC_2)

## Notes on the sheet
- [page 19 of 21 - PDF]
  - Create:  SOT.SchLib
  - No footprint: J38
- (in symbol Cap) X5R
- (in symbol CORE_RK3399) 3.3V; 1.8V; 1.8V & 3.0V; 3.0V

## Library data of the parts
C330-C347 C350-C353 = Cap: Capacitor; Published: 8-Jun-2000; LatestRevisionDate: 17-Jul-2002; LatestRevisionNote: Re-released for DXP Platform.; PackageReference: RAD-0.3; Publisher: Altium Limited; PackageDescription: Radial Cap, Thru-Hole; 2 Leads; 0.3 in Pin Spacing
TP13-TP15 = TP1: Test Point; Value: Test Point